# EAGLE design NIRGM V9 (EAGLE 8.5.1)

## Sheet 1 of 7: Voltage Regulator
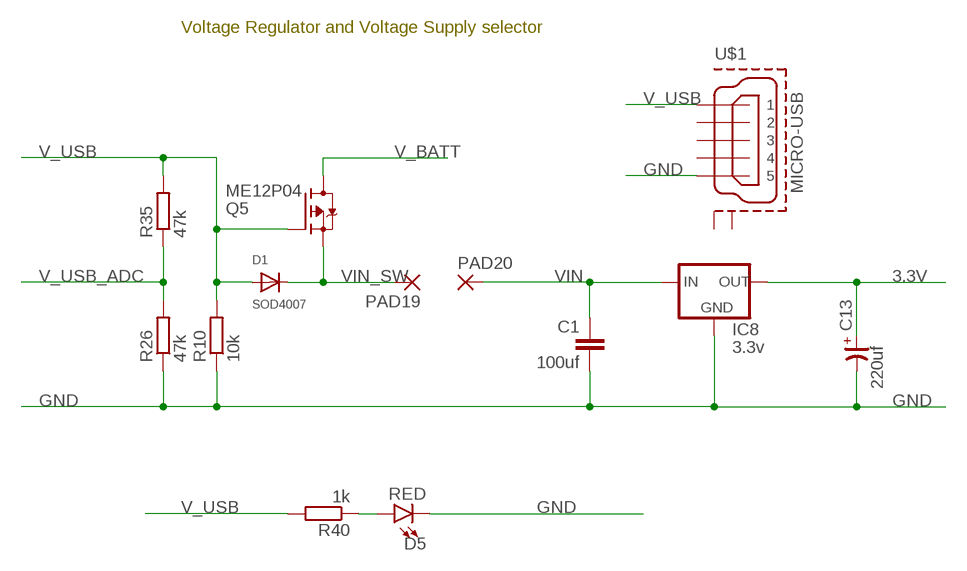
[diagram p0: schematic, sheet 1]

### Parts
C1  100uf  C-EUC1206K  [C1206K]
C13  220uf  CP-7343  [7343/T]
D1  SOD4007  DIODE_SOD-123FL  [SOD-123FL]
D5  RED  LED-GREEN1206  [LED-1206]
IC8  3.3v  LM1117TO252  [TO252]
PAD19  SMD2  [SMD1,27-2,54]
PAD20  SMD2  [SMD1,27-2,54]
Q5  ME12P04  FDD4141TO252  [TO252]
R10  10k  R-EU_R1206  [R1206]
R26  47k  R-EU_R1206  [R1206]
R35  47k  R-EU_R1206  [R1206]
R40  1k  R-EU_R1206  [R1206]
U$1  MICRO-USB  MICRO-USB-RECEPTACLE47589-0001  [47589-0001]

### Nets
3.3V: C13.+ IC8.3(OUT) ; also sheet 3,4,5,6,7
GND: C1.2 C13.- D5.C IC8.1(GND) R10.1 R26.1 U$1.5 ; also sheet 2,3,4,5,6,7
N$1: D5.A R40.1
V_BATT: Q5.3(D) ; also sheet 2,6
V_USB: D1.A Q5.1(G) R10.2 R35.2 R40.2 U$1.1 ; also sheet 2,6
V_USB_ADC: R26.2 R35.1 ; also sheet 4
VIN: C1.1 IC8.2(IN) PAD20.1(P)
VIN_SW: D1.C PAD19.1(P) Q5.2(S)
Unconnected: U$1.2 U$1.3 U$1.4 U$1.P$1(GND1) U$1.P$2(GND2)

### Notes on the sheet
- Voltage Regulator and Voltage Supply selector

## Sheet 2 of 7: Lithium-Polymer Battery Charger (1-cell)
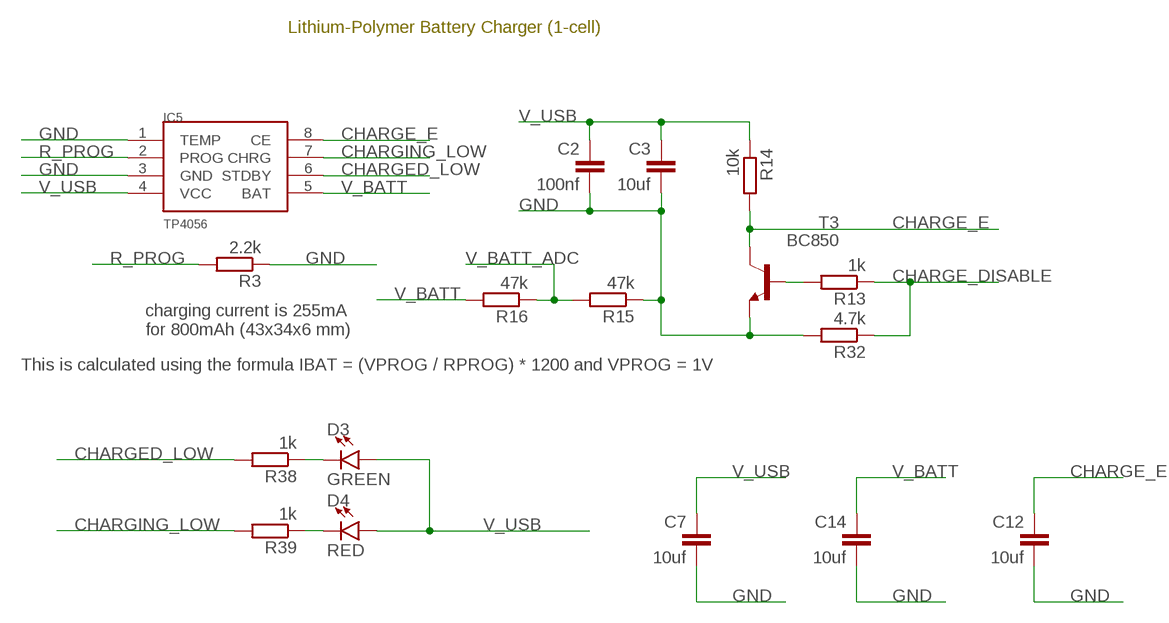
[diagram p1: schematic, sheet 2]

### Parts
C2  100nf  C-EUC1206K  [C1206K]
C3  10uf  C-EUC1206K  [C1206K]
C7  10uf  C-EUC1206K  [C1206K]
C12  10uf  C-EUC1206K  [C1206K]
C14  10uf  C-EUC1206K  [C1206K]
D3  GREEN  LED-GREEN1206  [LED-1206]
D4  RED  LED-GREEN1206  [LED-1206]
IC5  TP4056  [SOP-8]
R3  2.2k  R-EU_R1206  [R1206]
R13  1k  R-EU_R1206  [R1206]
R14  10k  R-EU_R1206  [R1206]
R15  47k  R-EU_R1206  [R1206]
R16  47k  R-EU_R1206  [R1206]
R32  4.7k  R-EU_R1206  [R1206]
R38  1k  R-EU_R1206  [R1206]
R39  1k  R-EU_R1206  [R1206]
T3  BC850  [SOT23]

### Nets
CHARGE_DISABLE: R13.1 R32.1 ; also sheet 4
CHARGE_E: C12.1 IC5.8(CE) R14.2 T3.3(C)
CHARGED_LOW: IC5.6(STDBY) R38.2 ; also sheet 4
CHARGING_LOW: IC5.7(CHRG) R39.2 ; also sheet 4
GND: C2.2 C3.2 C7.2 C12.2 C14.2 IC5.1(TEMP) IC5.3(GND) R3.1 R15.1 R32.2 T3.2(E) ; also sheet 1,3,4,5,6,7
N$2: D4.C R39.1
N$4: D3.C R38.1
N$13: R13.2 T3.1(B)
R_PROG: IC5.2(PROG) R3.2
V_BATT: C14.1 IC5.5(BAT) R16.2 ; also sheet 1,6
V_BATT_ADC: R15.2 R16.1 ; also sheet 4
V_USB: C2.1 C3.1 C7.1 D3.A D4.A IC5.4(VCC) R14.1 ; also sheet 1,6

### Notes on the sheet
- Lithium-Polymer Battery Charger (1-cell)
- charging current is 255mA
  for 800mAh (43x34x6 mm)
- This is calculated using the formula IBAT = (VPROG / RPROG) * 1200 and VPROG = 1V

## Sheet 3 of 7: LED Driver
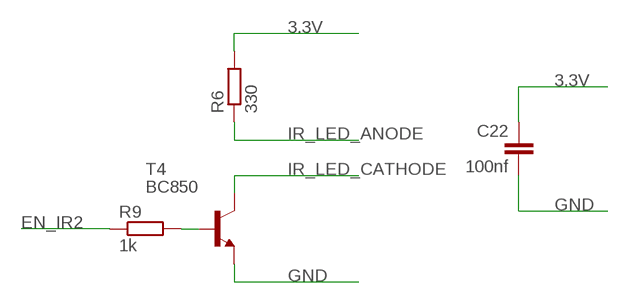
[diagram p2: schematic, sheet 3]

### Parts
C22  100nf  C-EUC1206K  [C1206K]
R6  330  R-EU_R1206  [R1206]
R9  1k  R-EU_R1206  [R1206]
T4  BC850  [SOT23]

### Nets
3.3V: C22.1 R6.2 ; also sheet 1,4,5,6,7
EN_IR2: R9.1 ; also sheet 4
GND: C22.2 T4.2(E) ; also sheet 1,2,4,5,6,7
IR_LED_ANODE: R6.1 ; also sheet 5
IR_LED_CATHODE: T4.3(C) ; also sheet 5
N$8: R9.2 T4.1(B)

## Sheet 4 of 7: ESP32
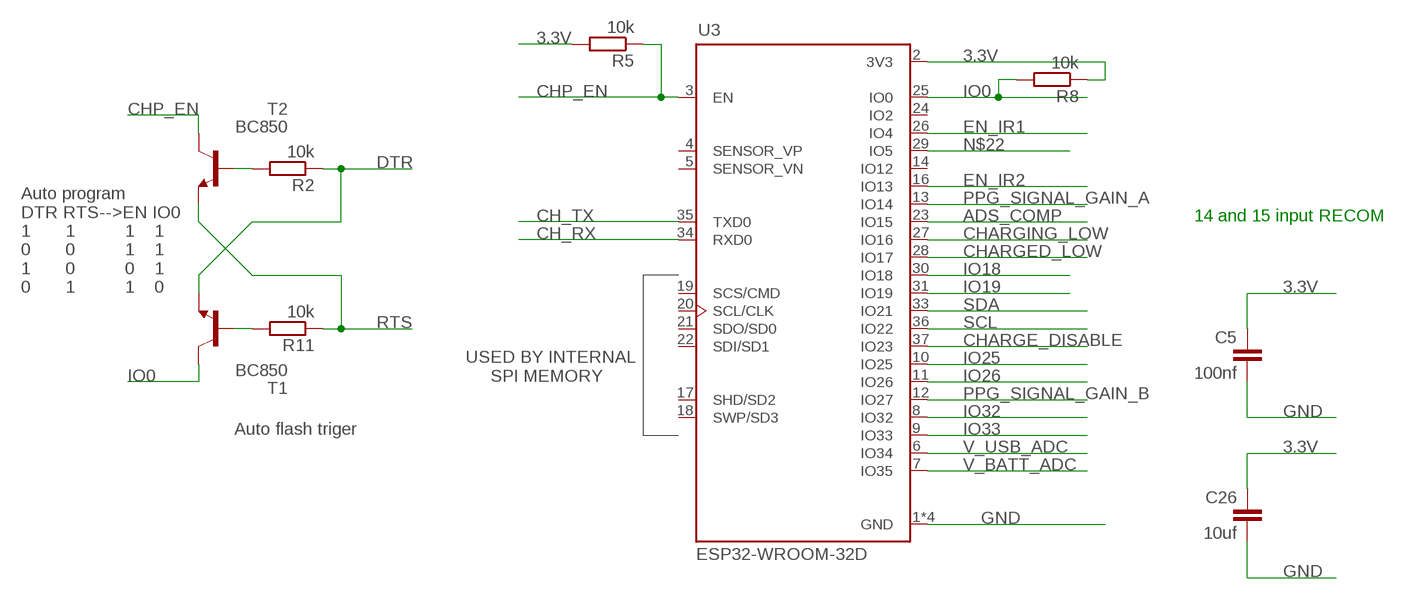
[diagram p3: schematic, sheet 4]

### Parts
C5  100nf  C-EUC1206K  [C1206K]
C26  10uf  C-EUC1206K  [C1206K]
R2  10k  R-EU_R1206  [R1206]
R5  10k  R-EU_R1206  [R1206]
R8  10k  R-EU_R1206  [R1206]
R11  10k  R-EU_R1206  [R1206]
T1  BC850  [SOT23]
T2  BC850  [SOT23]
U3  ESP32-WROOM-32D  [MODULE_ESP32-WROOM-32D]

### Nets
3.3V: C5.1 C26.1 R5.2 R8.1 U3.2(3V3) ; also sheet 1,3,5,6,7
ADS_COMP: U3.23(IO15) ; also sheet 7
CH_RX: U3.34(RXD0) ; also sheet 6
CH_TX: U3.35(TXD0) ; also sheet 6
CHARGE_DISABLE: U3.37(IO23) ; also sheet 2
CHARGED_LOW: U3.28(IO17) ; also sheet 2
CHARGING_LOW: U3.27(IO16) ; also sheet 2
CHP_EN: R5.1 T2.3(C) U3.3(EN) ; also sheet 6
DTR: R2.1 T1.2(E) ; also sheet 6
EN_IR1: U3.26(IO4)
EN_IR2: U3.16(IO13) ; also sheet 3
GND: C5.2 C26.2 U3.1(GND) U3.15(GND) U3.38(GND) U3.39(GND) ; also sheet 1,2,3,5,6,7
IO0: R8.2 T1.3(C) U3.25(IO0) ; also sheet 6
IO18: U3.30(IO18) ; also sheet 6
IO19: U3.31(IO19) ; also sheet 6
IO25: U3.10(IO25) ; also sheet 6
IO26: U3.11(IO26) ; also sheet 6
IO32: U3.8(IO32) ; also sheet 6
IO33: U3.9(IO33) ; also sheet 6
N$5: R11.2 T1.1(B)
N$18: R2.2 T2.1(B)
N$22: U3.29(IO5)
PPG_SIGNAL_GAIN_A: U3.13(IO14) ; also sheet 5
PPG_SIGNAL_GAIN_B: U3.12(IO27) ; also sheet 5
RTS: R11.1 T2.2(E) ; also sheet 6
SCL: U3.36(IO22) ; also sheet 6,7
SDA: U3.33(IO21) ; also sheet 6,7
V_BATT_ADC: U3.7(IO35) ; also sheet 2
V_USB_ADC: U3.6(IO34) ; also sheet 1
Unconnected: U3.4(SENSOR_VP) U3.5(SENSOR_VN) U3.14(IO12) U3.17(SHD/SD2) U3.18(SWP/SD3) U3.19(SCS/CMD) U3.20(SCL/CLK) U3.21(SDO/SD0) U3.22(SDI/SD1) U3.24(IO2)

### Notes on the sheet
- 14 and 15 input RECOM
- Auto program
  DTR RTS-->EN IO0 
  1       1          1    1
  0       0          1    1
  1       0          0    1
  0       1          1    0
- USED BY INTERNAL
       SPI MEMORY
- Auto flash triger

## Sheet 5 of 7: Sensor and signal processing
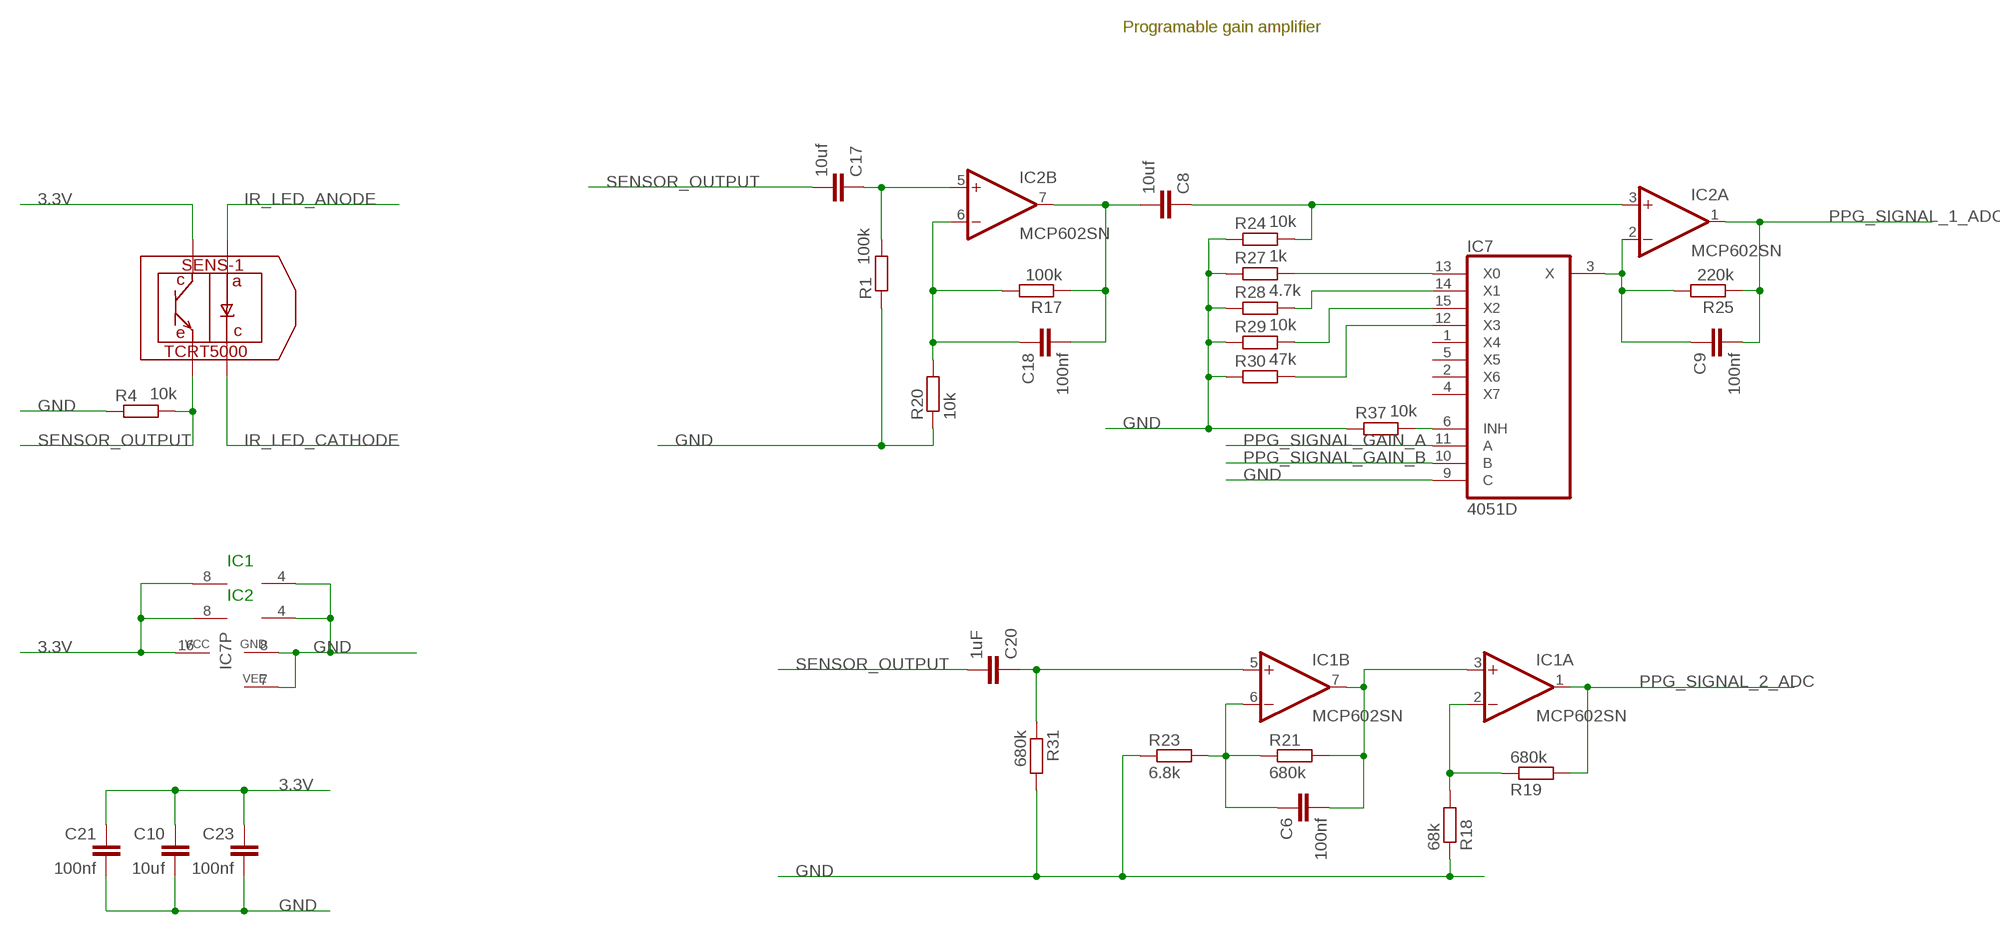
[diagram p4: schematic, sheet 5]

### Parts
C6  100nf  C-EUC1206K  [C1206K]
C8  10uf  C-EUC1206K  [C1206K]
C9  100nf  C-EUC1206K  [C1206K]
C10  10uf  C-EUC1206K  [C1206K]
C17  10uf  C-EUC1206K  [C1206K]
C18  100nf  C-EUC1206K  [C1206K]
C20  1uF  C-EUC1206K  [C1206K]
C21  100nf  C-EUC1206K  [C1206K]
C23  100nf  C-EUC1206K  [C1206K]
IC1  MCP602SN  [SO08]
IC2  MCP602SN  [SO08]
IC7  4051D  [SO16]
R1  100k  R-EU_R1206  [R1206]
R4  10k  R-EU_R1206  [R1206]
R17  100k  R-EU_R1206  [R1206]
R18  68k  R-EU_R1206  [R1206]
R19  680k  R-EU_R1206  [R1206]
R20  10k  R-EU_R1206  [R1206]
R21  680k  R-EU_R1206  [R1206]
R23  6.8k  R-EU_R1206  [R1206]
R24  10k  R-EU_R1206  [R1206]
R25  220k  R-EU_R1206  [R1206]
R27  1k  R-EU_R1206  [R1206]
R28  4.7k  R-EU_R1206  [R1206]
R29  10k  R-EU_R1206  [R1206]
R30  47k  R-EU_R1206  [R1206]
R31  680k  R-EU_R1206  [R1206]
R37  10k  R-EU_R1206  [R1206]
SENS-1  TCRT5000  [5000]

### Nets
3.3V: C10.1 C21.1 C23.1 IC1.8(P:V+) IC2.8(P:V+) IC7.16(VCC) SENS-1.P$1 ; also sheet 1,3,4,6,7
GND: C10.2 C21.2 C23.2 IC1.4(P:V-) IC2.4(P:V-) IC7.7(VEE) IC7.8(GND) IC7.9(C) R1.1 R4.1 R18.1 R20.1 R23.1 R24.1 R27.1 R28.1 R29.1 R30.1 R31.2 R37.1 ; also sheet 1,2,3,4,6,7
IR_LED_ANODE: SENS-1.P$3 ; also sheet 3
IR_LED_CATHODE: SENS-1.P$4 ; also sheet 3
N$3: IC1.2(A:-IN) R18.2 R19.1
N$6: C17.1 IC2.5(B:+IN) R1.2
N$11: IC7.6(INH) R37.2
N$12: C8.2 C18.2 IC2.7(B:OUT) R17.1
N$14: C18.1 IC2.6(B:-IN) R17.2 R20.2
N$15: C6.1 IC1.6(B:-IN) R21.1 R23.2
N$16: C20.1 IC1.5(B:+IN) R31.1
N$17: C6.2 IC1.3(A:+IN) IC1.7(B:OUT) R21.2
N$29: C8.1 IC2.3(A:+IN) R24.2
N$39: C9.1 IC2.2(A:-IN) IC7.3(X) R25.2
N$40: IC7.13(X0) R27.2
N$41: IC7.14(X1) R28.2
N$42: IC7.15(X2) R29.2
N$43: IC7.12(X3) R30.2
PPG_SIGNAL_1_ADC: C9.2 IC2.1(A:OUT) R25.1 ; also sheet 7
PPG_SIGNAL_2_ADC: IC1.1(A:OUT) R19.2 ; also sheet 7
PPG_SIGNAL_GAIN_A: IC7.11(A) ; also sheet 4
PPG_SIGNAL_GAIN_B: IC7.10(B) ; also sheet 4
SENSOR_OUTPUT: C17.2 C20.2 R4.2 SENS-1.P$2
Unconnected: IC7.1(X4) IC7.2(X6) IC7.4(X7) IC7.5(X5)

### Notes on the sheet
- Programable gain amplifier
- IC1
- IC2

## Sheet 6 of 7: OLED LCD and Connectors
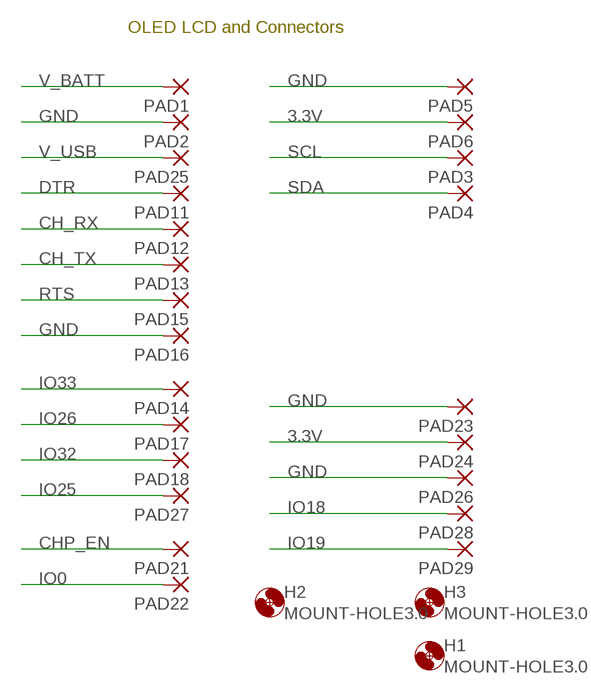
[diagram p5: schematic, sheet 6]

### Parts
H1  MOUNT-HOLE3.0  [3,0]
H2  MOUNT-HOLE3.0  [3,0]
H3  MOUNT-HOLE3.0  [3,0]
PAD1  WIREPADSMD5-2,5  [5-2,5]
PAD2  WIREPADSMD5-2,5  [5-2,5]
PAD3  SMD2  [SMD1,27-2,54]
PAD4  SMD2  [SMD1,27-2,54]
PAD5  SMD2  [SMD1,27-2,54]
PAD6  SMD2  [SMD1,27-2,54]
PAD11  SMD2  [SMD1,27-2,54]
PAD12  SMD2  [SMD1,27-2,54]
PAD13  SMD2  [SMD1,27-2,54]
PAD14  SMD2  [SMD1,27-2,54]
PAD15  SMD2  [SMD1,27-2,54]
PAD16  SMD2  [SMD1,27-2,54]
PAD17  SMD2  [SMD1,27-2,54]
PAD18  SMD2  [SMD1,27-2,54]
PAD21  SMD2  [SMD1,27-2,54]
PAD22  SMD2  [SMD1,27-2,54]
PAD23  SMD2  [SMD1,27-2,54]
PAD24  SMD2  [SMD1,27-2,54]
PAD25  SMD2  [SMD1,27-2,54]
PAD26  SMD2  [SMD1,27-2,54]
PAD27  SMD2  [SMD1,27-2,54]
PAD28  SMD2  [SMD1,27-2,54]
PAD29  SMD2  [SMD1,27-2,54]

### Nets
3.3V: PAD6.1(P) PAD24.1(P) ; also sheet 1,3,4,5,7
CH_RX: PAD12.1(P) ; also sheet 4
CH_TX: PAD13.1(P) ; also sheet 4
CHP_EN: PAD21.1(P) ; also sheet 4
DTR: PAD11.1(P) ; also sheet 4
GND: PAD2.1(P) PAD5.1(P) PAD16.1(P) PAD23.1(P) PAD26.1(P) ; also sheet 1,2,3,4,5,7
IO0: PAD22.1(P) ; also sheet 4
IO18: PAD28.1(P) ; also sheet 4
IO19: PAD29.1(P) ; also sheet 4
IO25: PAD27.1(P) ; also sheet 4
IO26: PAD17.1(P) ; also sheet 4
IO32: PAD18.1(P) ; also sheet 4
IO33: PAD14.1(P) ; also sheet 4
RTS: PAD15.1(P) ; also sheet 4
SCL: PAD3.1(P) ; also sheet 4,7
SDA: PAD4.1(P) ; also sheet 4,7
V_BATT: PAD1.1(P) ; also sheet 1,2
V_USB: PAD25.1(P) ; also sheet 1,2

### Notes on the sheet
- OLED LCD and Connectors

## Sheet 7 of 7: ADS1115
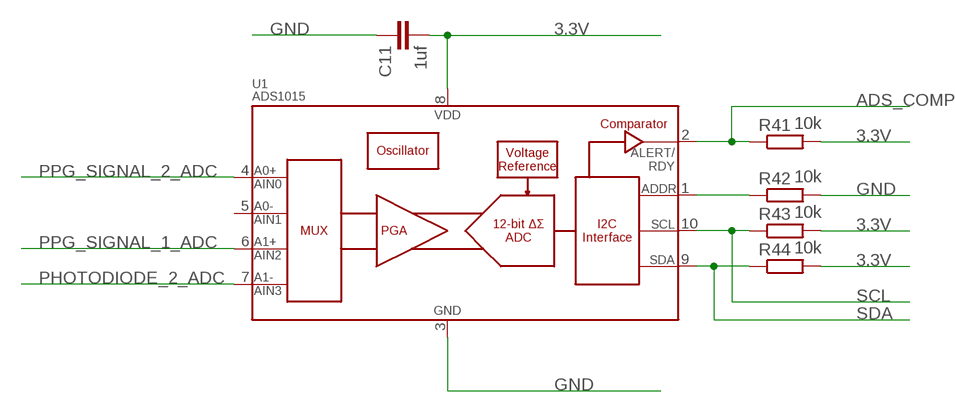
[diagram p6: schematic, sheet 7]

### Parts
C11  1uf  C-EUC1206K  [C1206K]
R41  10k  R-EU_R1206  [R1206]
R42  10k  R-EU_R1206  [R1206]
R43  10k  R-EU_R1206  [R1206]
R44  10k  R-EU_R1206  [R1206]
U1  ADS1015  [MSOP10]

### Nets
3.3V: C11.2 R41.2 R43.2 R44.2 U1.8(VDD) ; also sheet 1,3,4,5,6
ADS_COMP: R41.1 U1.2(ALERT/RDY) ; also sheet 4
GND: C11.1 R42.2 U1.3(VSS) ; also sheet 1,2,3,4,5,6
N$9: R42.1 U1.1(ADDR)
PHOTODIODE_2_ADC: U1.7(AIN3)
PPG_SIGNAL_1_ADC: U1.6(AIN2) ; also sheet 5
PPG_SIGNAL_2_ADC: U1.4(AIN0) ; also sheet 5
SCL: R43.1 U1.10(SCL) ; also sheet 4,6
SDA: R44.1 U1.9(SDA) ; also sheet 4,6
Unconnected: U1.5(AIN1)

## Library data of the parts
C1-C3 C5-C12 C14 C17 C18 C20-C23 C26 = rcl:C-EU: CAPACITOR, European symbol; SPICEPREFIX: C
C13 = cap-master:CP-: POLARIZED CAP
D1 = adafruit:DIODE: Diode SMADIODE - SMA Surface Mount Package 20V 1A Schottky Diode Digikey: 641-1014-6-ND DO-1N4148 - Through Hole Small Current Diode SOD-123 20V 1 A (.5mV Vf) Schottky Diode - Digikey: MBRX120TPMSCT-ND SOD-323 10V 570mA (.38mV Vf, 3ns) Schottky Diode - Digikey: ZLLS410CT-ND SOD-523 30V 30mA Schottky Diode (RB751S-40TE61) - Digikey: RB751S-40TE61CT-ND SOT23-R/W - SOT23 Package (R = Solder Paste/Reflow Ovens, W = Hand-Soldering) BAT54Film 40V 300mA - Digikey: 497-7162-1-ND
D3 = SparkFun-LED:LED-GREEN: Green SMD LED Used in manufacturing of various products at SparkFun Packages: 0603 - SMD 0603 package [Product Link] <http://www.futureelectronics.com/en/technologies/semiconductors/optoelectronics/leds/Pages/9894312-LTST-C190GKT.aspx?CrossPart=HSMG-C190&IM=0> LilyPad 1206 - SMD1206 LilyPad package [Product Link] <http://www.futureelectronics.com/en/Technologies/Product.aspx?ProductID=IN150NGHARVATEKCORPORATION2049943&IM=0> 1206 - SMD1206 package [Product Link] <http://www.futureelectronics.com/en/technologies/semiconductors/optoelectronics/leds/Pages/8315665-LTST-C150KGKT.aspx?IM=0> 1206 Bottom Mount -SMD 1206 Bottom Mount [Product Link] <http://www.digikey.com/product-detail/en/lite-on-inc/LTST-C230KGKT/160-1456-1-ND/386854> SparkFun Products: Pro Mini 328 -5V <https://www.sparkfun.com/products/821> RedBoard <https://www.sparkfun.com/products/12757> MP3 Trigger <https://www.sparkfun.com/products/13720> Makey Makey <https://www.sparkfun.com/products/11076>; PROD_ID: DIO-00862
D4 D5 = SparkFun-LED:LED-GREEN: Green SMD LED Used in manufacturing of various products at SparkFun Packages: 0603 - SMD 0603 package [Product Link] <http://www.futureelectronics.com/en/technologies/semiconductors/optoelectronics/leds/Pages/9894312-LTST-C190GKT.aspx?CrossPart=HSMG-C190&IM=0> LilyPad 1206 - SMD1206 LilyPad package [Product Link] <http://www.futureelectronics.com/en/Technologies/Product.aspx?ProductID=IN150NGHARVATEKCORPORATION2049943&IM=0> 1206 - SMD1206 package [Product Link] <http://www.futureelectronics.com/en/technologies/semiconductors/optoelectronics/leds/Pages/8315665-LTST-C150KGKT.aspx?IM=0> 1206 Bottom Mount -SMD 1206 Bottom Mount [Product Link] <http://www.digikey.com/product-detail/en/lite-on-inc/LTST-C230KGKT/160-1456-1-ND/386854> SparkFun Products: Pro Mini 328 -5V <https://www.sparkfun.com/products/821> RedBoard <https://www.sparkfun.com/products/12757> MP3 Trigger <https://www.sparkfun.com/products/13720> Makey Makey <https://www.sparkfun.com/products/11076>; PROD_ID: DIO-00862; VALUE: GREEN
H1-H3 = holes:MOUNT-HOLE: MOUNTING HOLE with drill center marker
IC1 IC2 = linear:MCP602: Single Op Amp 2.7V to 6.0V Single Supply CMOS Source: http://ww1.microchip.com/downloads/en/DeviceDoc/21314g.pdf
IC5 = TP4056:TP4056
IC7 = 40xx:4051: 8-channel ANALOG MULTIPLEXER
IC8 = v-reg-2:LM1117
PAD1 PAD2 = wirepad:WIREPAD: Wire PAD connect wire on PCB
PAD3-PAD6 PAD11-PAD29 = wirepad:SMD2: SMD PAD
Q5 = transistor-fet:FDD4141: P-Channel PowerTrench® MOSFET Source: FDD4141.pdf
R1-R6 R8-R11 R13-R21 R23-R32 R35 R37-R44 = rcl:R-EU_: RESISTOR, European symbol; SPICEPREFIX: R
SENS-1 = qfm-trx1-24g:TCRT5000: Reflective Optical Sensor with Transistor Output. Vishay Semiconductors
T1-T4 = transistor:BC850: NPN TRANSISTOR
U1 = SparkFun-IC-Conversion:ADS1015: ADS1015 12-BIT ADC 12-Bit Del-Sig ADC Four single-ended inputs or two differential inputs Internal PGA I2C interface 2.0-5.5V SparkFun Products SparkFun Block for Intel Edison - ADC <https://www.sparkfun.com/products/13770> (DEV-13770); PROD_ID: IC-12270
U3 = ESP32-WROOM-32DMODED:ESP32-WROOM-32D: IC: SoC; GPIO, I2C, I2S, IR, SD, SDIO, SPI, UART; 2.7÷3.6VDC; 20dBm; AVAILABILITY: Unavailable; DESCRIPTION: IC: SoC; GPIO, I2C, I2S, IR, SD, SDIO, SPI, UART; 2.7÷3.6VDC; 20dBm; MF: Espressif Systems; MP: ESP32-WROOM-32D; PACKAGE: Module Espressif Systems; PRICE: None
U$1 = con-molex-usb:MICRO-USB-RECEPTACLE: MICRO USB RECEPTACLES Micro-USB Receptacles, SMT, Lead-Free from MOLEX <http://www.molex.com/>. (C) 2014 Tomasz Boleslaw CEDRO, cederom@tlen.pl, http://www.tomek.cedro.info. Version 0.1 (2014-01-17): Initial release. Version 0.2 (2014-02-06): Updated 47589-0001 footprint pins/pads/milling. Following devices are included: 1. 47589-0001 Micro-USB AB Receptacle, Bottom Mount, SMT, Lead-Free <http://www.molex.com/molex/products/datasheet.jsp?part=active/0475890001_IO_CONNECTORS.xml> (Technical Drawing <http://www.molex.com/pdm_docs/sd/475890001_sd.pdf>).

## Board
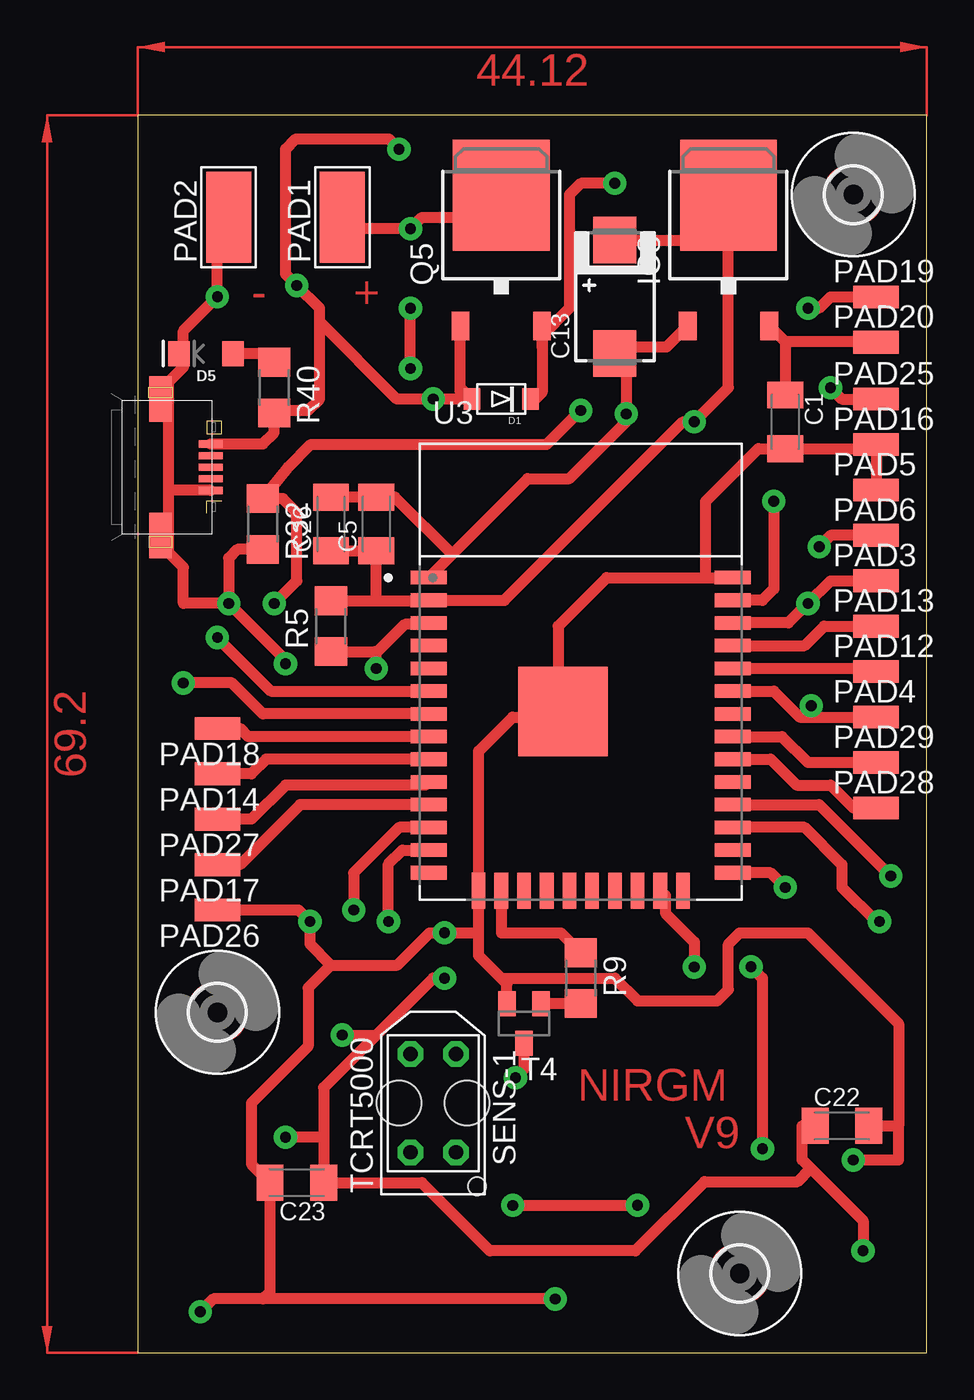
[diagram p7: board, top side]
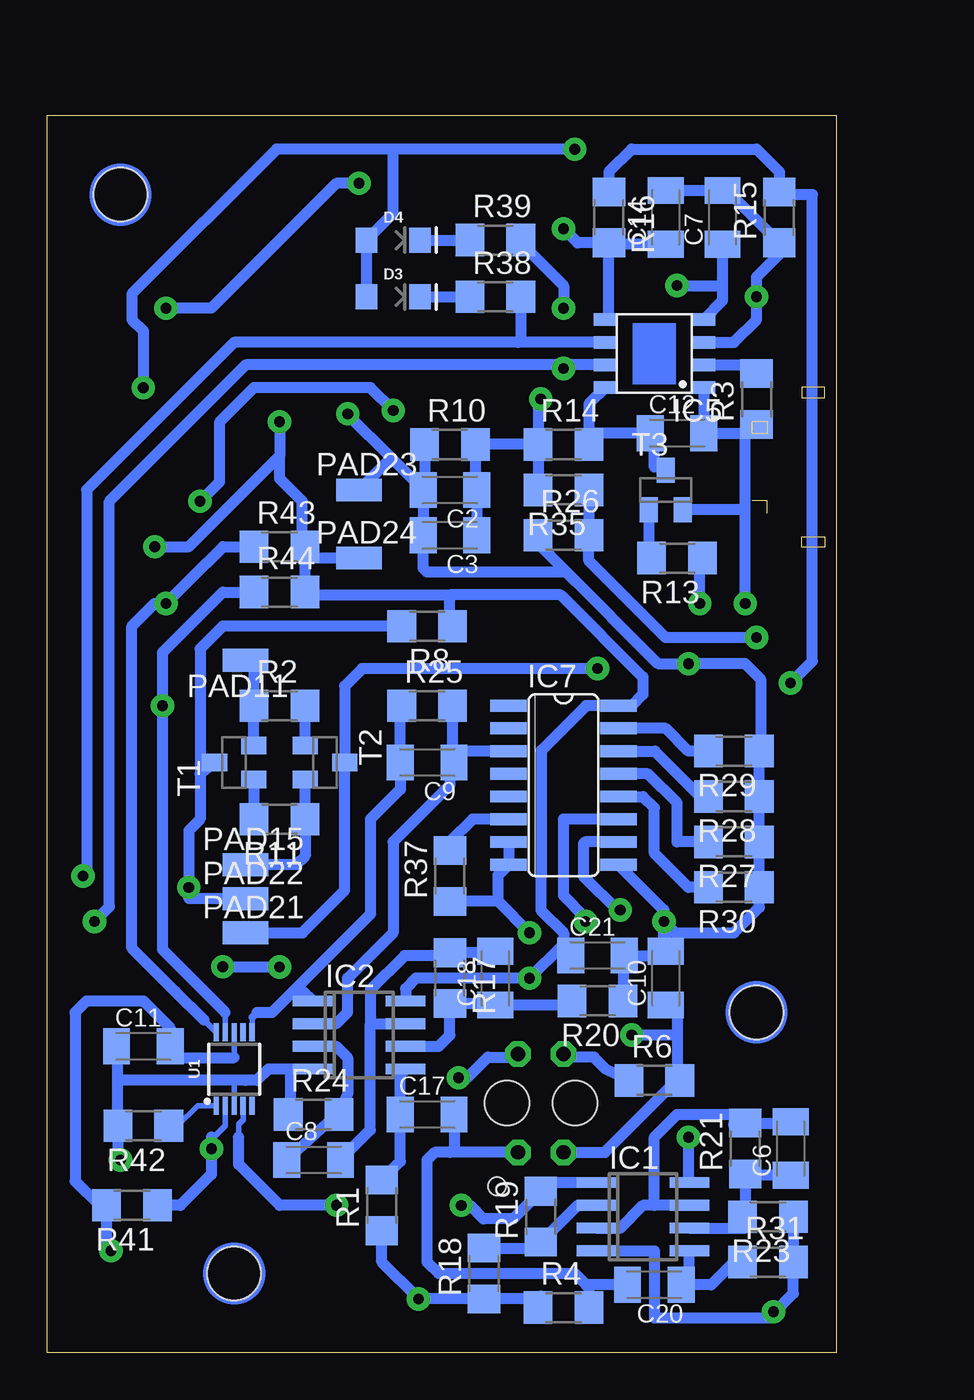
[diagram p8: board, bottom side, seen from below]

Size 44.12 x 69.2 mm. Coordinates in mm from the lower left corner, seen from the top.
Outline: 0,0 44.12,0 44.12,69.2 0,69.2 0,0
Copper layers (1*16): Top 0.035mm / dielectric 1.5mm / Bottom 0.035mm
Design rules "default *": minimum track width 6mil, minimum drill 0.35mm, track to track 12mil, track to pad 12mil, pad to pad 6mil, via to via 6mil, smd to smd 6mil, copper to edge 40mil, drill to drill 6mil, minimum pad ring 10mil, minimum via ring 8mil, stop-mask expansion 4mil, vias tented up to drill 0mil, thermal gap 10mil

### Footprints (pad centres in the part's own frame; a part is rotated, then mirrored left to right if it is on the bottom)
C1206K = smd 1.5 x 2: 1 -1.5,0; 2 1.5,0
7343/T = smd 2.6 x 2.4: + 3.175,0; - -3.175,0
SOD-123FL = smd 0.91 x 1.22: A 1.637,0; C -1.637,0
LED-1206 = smd 1.2 x 1.4: A -1.5,0; C 1.5,0
3,0 = hole 3: 0,0
SO08 = smd 0.6 x 2.2: 1 -1.905,-2.6; 2 -0.635,-2.6; 3 0.635,-2.6; 4 1.905,-2.6; 5 1.905,2.6; 6 0.635,2.6; 7 -0.635,2.6; 8 -1.905,2.6
SOP-8 = smd 1.3 x 0.7: 1 -2.75,1.905; 2 -2.75,0.635; 3 -2.75,-0.635; 4 -2.75,-1.905; 5 2.75,-1.905; 6 2.75,-0.635; 7 2.75,0.635; 8 2.75,1.905
SO16 = smd 0.66 x 2.032: 1 -4.445,-3.073; 2 -3.175,-3.073; 3 -1.905,-3.073; 4 -0.635,-3.073; 5 0.635,-3.073; 6 1.905,-3.073; 7 3.175,-3.073; 8 4.445,-3.073; 9 4.445,3.073; 10 3.175,3.073; 11 1.905,3.073; 12 0.635,3.073; 13 -0.635,3.073; 14 -1.905,3.073; 15 -3.175,3.073; 16 -4.445,3.073
TO252 = smd 1 x 1.6: 1 -2.28,-6.07; 2 2.28,-6.07 | smd 5.4 x 6.2: 3 0,1.23
5-2,5 = smd 2.54 x 5.08: 1 0,0
SMD1,27-2,54 = smd 1.27 x 2.54: 1 0,0
TO252' = smd 1 x 1.6: 1 -2.28,-4.8; 2 2.28,-4.8 | smd 5.4 x 6.2: 3 0,2.5
R1206 = smd 1.6 x 1.803: 1 -1.422,0; 2 1.422,0
5000 = drill 0.8 pad 1.422 octagon: P$1 -2.75,1.27; P$2 -2.75,-1.27; P$3 2.75,1.27; P$4 2.75,-1.27 | hole 2.5: 0,1.9; 0,-1.9 | hole 1: -4.65,-2.45
SOT23 = smd 1 x 1.4: 1 -0.95,-1.1; 2 0.95,-1.1; 3 0,1.1
MSOP10 = smd 0.3 x 1: 1 -1,-2.05; 2 -0.5,-2.05; 3 0,-2.05; 4 0.5,-2.05; 5 1,-2.05; 6 1,2.05; 7 0.5,2.05; 8 0,2.05; 9 -0.5,2.05; 10 -1,2.05
MODULE_ESP32-WROOM-32D = smd 2 x 0.762: 1 -8.5,5.26; 2 -8.5,3.99; 3 -8.5,2.72; 4 -8.5,1.45; 5 -8.5,0.18; 6 -8.5,-1.09; 7 -8.5,-2.36; 8 -8.5,-3.63; 9 -8.5,-4.9; 10 -8.5,-6.17; 11 -8.5,-7.44; 12 -8.5,-8.71; 13 -8.5,-9.98; 14 -8.5,-11.25; 25 8.5,-11.25; 26 8.5,-9.98; 27 8.5,-8.71; 28 8.5,-7.44; 29 8.5,-6.17; 30 8.5,-4.9; 31 8.5,-3.63; 32 8.5,-2.36; 33 8.5,-1.09; 34 8.5,0.18; 35 8.5,1.45; 36 8.5,2.72; 37 8.5,3.99; 38 8.5,5.26 | smd 0.762 x 2: 15 -5.715,-12.25; 16 -4.445,-12.25; 17 -3.175,-12.25; 18 -1.905,-12.25; 19 -0.635,-12.25; 20 0.635,-12.25; 21 1.905,-12.25; 22 3.175,-12.25; 23 4.445,-12.25; 24 5.715,-12.25 | smd 5 x 5: 39 -1,-2.24
47589-0001 = smd 1.35 x 0.4: 1 2.8,1.3; 2 2.8,0.65; 3 2.8,0; 4 2.8,-0.65; 5 2.8,-1.3 | smd 1.27 x 2.54: P$1 0,3.81; P$2 0,-3.81

### Placement (x,y rotation side)
C1  36.2,52.07 270 top
C2  21.59,48.26 180 bottom
C3  21.59,45.72 180 bottom
C5  13.34,46.35 90 top
C6  2.54,11.43 90 bottom
C7  6.35,63.5 90 bottom
C8  29.21,10.79 0 bottom
C9  22.86,33.02 180 bottom
C10  9.53,20.95 90 bottom
C11  38.73,17.14 0 bottom
C12  8.89,51.44 0 bottom
C13  26.67,59.05 90 top
C14  9.53,63.5 90 bottom
C17  22.86,13.34 0 bottom
C18  19.05,20.95 90 bottom
C20  10.16,3.81 180 bottom
C21  13.34,22.23 0 bottom
C22  39.37,12.7 0 top
C23  8.89,9.53 180 top
C26  10.79,46.35 90 top
D1  20.32,53.34 180 top
D3  24.77,59.05 0 bottom
D4  24.77,62.23 0 bottom
D5  3.81,55.88 180 top
H1  40.01,64.77 0 top
H2  4.45,19.05 0 top
H3  33.66,4.45 0 top
IC1  10.79,7.62 270 bottom
IC2  26.67,17.78 270 bottom
IC5  10.16,55.88 180 bottom
IC7  15.24,31.75 270 bottom
IC8  33.02,63.5 0 top
PAD1  11.43,63.5 0 top
PAD2  5.08,63.5 0 top
PAD3  41.27,43.18 270 top
PAD4  41.27,35.56 270 top
PAD5  41.27,48.26 270 top
PAD6  41.27,45.72 270 top
PAD11  33.02,38.73 90 bottom
PAD12  41.27,38.1 270 top
PAD13  41.27,40.64 270 top
PAD14  4.45,32.38 90 top
PAD15  33.02,27.3 270 bottom
PAD16  41.27,50.8 270 top
PAD17  4.45,27.3 90 top
PAD18  4.45,34.92 90 top
PAD19  41.27,59.05 270 top
PAD20  41.27,56.52 270 top
PAD21  33.02,23.5 270 bottom
PAD22  33.02,25.4 270 bottom
PAD23  26.67,48.26 270 bottom
PAD24  26.67,44.45 270 bottom
PAD25  41.27,53.34 270 top
PAD26  4.45,24.77 90 top
PAD27  4.45,29.84 90 top
PAD28  41.27,30.48 270 top
PAD29  41.27,33.02 270 top
Q5  ME12P04  [TO252']  20.32,62.23 0 top
R1  25.4,8.26 90 bottom
R2  31.11,36.2 0 bottom
R3  4.45,53.34 90 bottom
R4  15.24,2.54 0 bottom
R5  10.79,40.64 90 top
R6  10.16,15.24 0 bottom
R8  22.86,40.64 180 bottom
R9  24.77,20.95 270 top
R10  21.59,50.8 0 bottom
R11  31.11,29.84 180 bottom
R13  8.89,44.45 180 bottom
R14  15.24,50.8 0 bottom
R15  3.17,63.5 90 bottom
R16  12.7,63.5 270 bottom
R17  21.59,20.95 270 bottom
R18  19.68,4.45 90 bottom
R19  16.51,7.62 90 bottom
R20  13.34,19.68 180 bottom
R21  5.08,11.43 90 bottom
R23  3.81,7.62 180 bottom
R24  29.21,13.34 0 bottom
R25  22.86,36.2 0 bottom
R26  15.24,45.72 0 bottom
R27  5.71,28.57 180 bottom
R28  5.71,31.11 180 bottom
R29  5.71,33.66 180 bottom
R30  5.71,26.04 180 bottom
R31  3.81,5.08 0 bottom
R32  6.99,46.35 270 top
R35  15.24,48.26 180 bottom
R37  21.59,26.67 90 bottom
R38  19.05,59.05 0 bottom
R39  19.05,62.23 0 bottom
R40  7.62,53.98 270 top
R41  39.37,8.26 180 bottom
R42  38.73,12.7 180 bottom
R43  31.11,45.09 0 bottom
R44  31.11,42.55 0 bottom
SENS-1  16.51,13.97 90 top
T1  33.66,33.02 90 bottom
T2  28.57,33.02 270 bottom
T3  9.53,48.26 0 bottom
T4  21.59,18.41 180 top
U1  33.66,15.88 0 bottom
U3  24.77,38.1 0 top
U$1  1.27,49.53 0 top

### Tracks (layer width: path | path; a pad name or v marks a point on that pad's centre or on a via)
3.3V  (via drill 0.6 pad 1.3)
  Top 0.61: IC8.3 33.02,53.98 v31.11,52.07 30.48,52.07 20.5,42.09 U3.2 16.24,42.06 13.34,42.06 | IC8.3 32.12,64.36 | R5.2 13.34,42.06 | 13.34,42.06 C5.1 C26.1 | C13.+ 31.75,62.23 32.98,63.46 IC8.3 | v17.14,20.95 16.51,20.95 13.34,17.78 | 37.62,10.32 37.15,10.79 37.15,12.7 C22.1 | 37.62,10.32 40.55,7.39 v40.55,5.71 | 13.34,17.78 10.39,14.84 10.39,12.06 | PAD6.1 38.73,45.72 v38.1,45.09 | 10.39,12.06 C23.1 15.88,9.53 19.68,5.71 27.82,5.71 31.69,9.59 36.89,9.59 37.62,10.32 | 10.39,12.06 v8.26,12.06 | v11.43,17.78 13.34,17.78
  Bottom 0.305: 33.66,16.51 U1.8
  Bottom 0.61: v31.11,52.07 31.11,50.16 | v38.1,45.09 36.2,45.09 31.11,50.16 | 29.69,44.45 R44.2 29.54,42.39 21.59,42.39 | 29.69,44.45 R43.2 29.84,45.24 29.84,47.62 31.11,48.9 31.11,50.16 | 33.66,16.51 36.6,16.51 C11.2 37.23,18.18 38.73,19.68 41.91,19.68 42.55,19.05 42.55,9.62 41.18,8.26 R41.2 | 21.59,42.39 15.39,42.39 10.79,37.79 10.79,36.83 11.43,36.2 IC7.16 13.97,36.2 16.48,33.68 16.48,26.64 16.51,26.61 16.51,24.77 15.24,23.5 15.24,22.86 | R8.1 21.59,40.79 21.59,42.39 | PAD24.1 29.69,44.45 | IC2.8 24.07,20.38 23.5,20.95 v17.14,20.95 15.24,22.86 | R41.2 40.64,8.1 | C21.1 14.84,22.45 15.24,22.86 | C10.1 8.89,18.82 8.89,17.78 | 8.89,17.78 8.89,16.03 R6.2 8.91,15.24 12.93,11.22 SENS-1.P$1 | v8.26,12.06 8.26,9.59 IC1.8 | 8.89,17.78 v11.43,17.78 | v40.55,5.71 40.79,5.96 R41.2
ADS_COMP  (via drill 0.6 pad 1.3)
  Top 0.61: U3.23 29.49,25.57 29.49,24.6 31.11,22.97 v31.11,21.58 | v34.29,21.59 34.92,20.95 v34.92,11.42
  Bottom 0.305: U1.2 34.16,12.7 34.79,12.06 34.92,12.06
  Bottom 0.61: 34.92,12.06 v34.92,11.42 34.92,9.99 36.66,8.26 R41.1 | v31.11,21.58 v34.28,21.58 v34.29,21.59
CH_RX
  Top 0.61: PAD12.1 41.09,38.28 U3.34
CH_TX
  Top 0.61: U3.35 37.28,39.55 38.38,40.64 PAD13.1
CHARGE_DISABLE  (via drill 0.6 pad 1.3)
  Top 0.61: v24.77,52.7 22.86,50.8 9.68,50.8 8.41,49.53 R32.1 8.1,47.78 8.89,46.99 8.89,43.18 v7.62,41.91 | U3.37 34.92,42.09 35.56,42.73 v35.56,47.62
  Bottom 0.61: v7.62,41.91 7.62,44.45 R13.1 | v35.56,47.62 34.48,48.7 34.48,52.04 32.55,53.98 26.04,53.98 v24.77,52.7
CHARGE_E
  Bottom 0.61: IC5.8 13.82,53.07 13.82,51.44 | 13.82,51.44 R14.2 | 13.82,51.44 C12.1 10.16,51.2 10.16,49.53 9.7,49.53 T3.3
CHARGED_LOW  (via drill 0.6 pad 1.3)
  Top 0.61: U3.28 38.1,30.66 v42.09,26.67 v42.1,26.67
  Bottom 0.61: IC5.6 17.78,56.52 | 17.78,56.52 33.66,56.52 41.91,48.26 41.91,26.86 v42.1,26.67 | R38.2 17.63,56.67 17.78,56.52
CHARGING_LOW  (via drill 0.6 pad 1.3)
  Top 0.61: v15.24,55.05 v15.24,58.42 | U3.27 37.28,29.39 39.37,27.3 39.37,26.04 41.27,24.13 v41.47,24.13
  Bottom 0.61: IC5.7 15.24,55.24 | 15.24,55.24 v15.24,55.05 | v15.24,58.42 15.24,59.69 17.63,62.08 R39.2 | 15.24,55.24 33.02,55.24 40.64,47.62 40.64,24.96 v41.47,24.13
CHP_EN  (via drill 0.6 pad 1.3)
  Top 0.61: U3.3 16.19,40.74 14.93,40.74 13.34,39.15 | v13.34,38.27 13.34,39.15 | R5.1 13.27,39.22 13.34,39.15
  Bottom 0.61: v13.34,38.27 26.5,38.27 27.48,37.3 T2.3 27.48,25.86 29.84,23.5 PAD21.1
DTR
  Bottom 0.61: T1.2 32.55,36.18 R2.1 32.54,38.58 PAD11.1
EN_IR2
  Top 0.61: R9.1 23.65,23.5 20.32,23.5 U3.16
GND  (via drill 0.6 pad 1.3)
  Top 0.61: PAD2.1 5.08,62.23 4.45,61.59 v4.45,59.05 2.54,57.15 2.54,55.88 | U3.39 24.77,36.86 | 1.73,48.26 1.73,44.75 2.54,43.94 2.54,41.91 v5.08,41.91 | 1.73,48.26 1.73,54.31 2.54,55.12 2.54,55.88 | U3.39 23.5,36.13 23.5,40.64 26.21,43.36 31.75,43.36 | 31.75,43.36 U3.38 | U3.39 23.77,35.83 23.5,35.56 20.95,35.56 19.05,33.66 U3.15 19.05,23.5 | 31.75,43.36 31.75,47.62 34.7,50.57 C1.2 40.51,50.57 40.65,50.72 PAD16.1 PAD5.1 | 19.05,23.5 v17.14,23.5 16.31,23.5 14.5,21.69 10.79,21.69 | U3.1 17.57,44.66 | 17.57,44.66 21.8,48.9 24.13,48.9 27.3,52.07 v27.3,52.51 27.3,55.24 C13.- 26.95,56.16 27.18,56.24 29.55,56.24 IC8.1 | v5.08,41.91 8.26,38.73 v8.26,38.54 | 42.55,12.7 42.55,10.79 v40.01,10.79 | C22.2 42.55,12.7 | U$1.5 1.76,48.23 1.73,48.26 | v5.08,41.91 5.08,44.45 5.56,44.93 R32.2 | D5.C 2.54,55.88 | 17.57,44.66 14.38,47.85 C5.2 C26.2 | 9.63,23.39 v9.63,24.13 | v9.63,24.13 9.63,22.86 10.79,21.69 | T4.2 20.64,20.64 20.32,20.95 | 20.32,20.95 19.05,22.23 19.05,23.5 | 20.32,20.95 26.67,20.95 27.94,19.68 32.38,19.68 33.02,20.32 33.02,22.86 33.66,23.5 37.47,23.5 42.55,18.41 42.55,12.7 | v23.34,3.02 6.99,3.02 | 6.99,3.02 4.21,3.02 v3.49,2.3 | 6.99,3.02 7.39,3.43 C23.2 6.35,10.56 6.35,13.97 9.53,17.14 9.53,20.42 10.79,21.69 | v9.63,24.13 8.99,24.77 PAD26.1
  Bottom 0.305: U1.3 33.66,15.24 | 33.66,15.24 33.02,15.24 | 33.66,15.24 40.01,15.24 40.16,15.24
  Bottom 0.61: R10.1 23.01,48.34 C2.2 | C2.2 C3.2 23.09,43.89 22.86,43.66 15.09,43.66 14.61,43.18 | IC5.3 5.71,56.52 4.45,57.78 v4.45,59.05 4.45,60.17 3.17,61.44 R15.1 6.1,65 C7.2 C14.2 | v5.08,41.91 5.08,46.99 | T3.2 5.25,47.16 5.08,46.99 | 15.24,43.81 16.66,45.24 R26.1 16.83,45.55 | IC7.7 IC7.8 | 4.29,32.87 4.45,33.02 | IC7.8 19.05,27.3 | 14.61,43.18 | 14.61,43.18 15.24,43.81 | 15.24,43.81 | C2.2 24.88,50.05 | 24.88,50.05 27.3,52.48 v27.3,52.51 | IC7.9 9.63,24.77 v9.63,24.13 | C11.1 40.16,17.7 40.16,15.24 R42.2 40.16,10.95 v40.01,10.79 | v9.63,24.13 9.63,22.23 C21.2 11.91,22.15 R20.1 | 40.01,15.24 33.02,15.24 32.38,15.24 31.75,15.88 30.48,15.88 | 4.29,32.87 R29.1 4.21,33.73 4.21,37.68 5.08,38.54 v8.26,38.54 9.97,38.54 15.24,43.81 | 4.29,32.87 R28.1 R27.1 R30.1 4.29,24.92 5.71,23.5 8.99,23.5 v9.63,24.13 | IC2.4 30.48,15.88 | 5.08,51.44 C12.2 7.41,51.45 IC5.1 | 5.08,51.44 4.45,51.44 R3.1 | 5.08,46.99 5.08,51.44 | PAD23.1 24.88,50.05 | 20.8,25.25 R37.1 18.9,25.25 | v17.14,23.5 18.9,25.25 | 18.9,25.25 18.9,26.72 IC7.8 | R24.1 30.48,14.12 30.48,15.88 | C10.2 9.53,24.03 v9.63,24.13 | R23.1 R31.2 2.39,3.33 3.49,2.22 | 13.97,5.71 IC1.4 10.16,5.71 10.16,1.96 3.76,1.96 3.49,2.22 | 16.51,3.17 R4.1 16.81,3.02 R18.1 v23.34,3.02 25.4,5.08 R1.1 | v3.49,2.3 3.49,2.22
IO0  (via drill 0.6 pad 1.3)
  Top 0.61: v36.2,26.04 35.38,26.85 U3.25
  Bottom 0.61: R8.2 34.29,40.64 35.56,39.37 35.56,32.38 | 35.56,32.38 35.56,29.84 36.2,29.21 v36.2,26.04 36.2,25.4 PAD22.1 | T1.3 35.56,32.38
IO18
  Top 0.61: U3.30 35.38,33.2 36.83,31.75 38.73,31.75 40.01,30.48 PAD28.1
IO19
  Top 0.61: U3.31 36.02,34.47 37.47,33.02 PAD29.1
IO25
  Top 0.61: U3.10 16.09,31.75 8.26,31.75 6.35,29.84 PAD27.1
IO26
  Top 0.61: U3.11 9.07,30.66 5.71,27.3 PAD17.1
IO32
  Top 0.61: U3.8 6.17,34.47 5.71,34.92 PAD18.1
IO33
  Top 0.61: U3.9 7.17,33.2 6.35,32.38 PAD14.1
IR_LED_ANODE
  Bottom 0.61: R6.1 12.88,15.88 13.54,16.54 15.06,16.54 SENS-1.P$3
IR_LED_CATHODE  (via drill 0.6 pad 1.3)
  Top 0.61: T4.3 21.59,15.88 v21.11,15.39
  Bottom 0.61: v21.11,15.39 20.62,15.39 19.48,16.54 17.96,16.54 SENS-1.P$4
N$1
  Top 0.61: R40.1 7.47,55.4 6.99,55.88 D5.A
N$2
  Bottom 0.61: D4.C R39.1
N$3
  Bottom 0.61: IC1.2 14.45,8.26 R19.1 16.84,5.87 R18.2
N$4
  Bottom 0.61: D3.C R38.1
N$5
  Bottom 0.61: R11.2 32.54,32.05 T1.1
N$6
  Bottom 0.61: R1.2 24.36,10.72 C17.1 24.36,15.59 IC2.5
N$8
  Top 0.61: R9.2 24.15,19.52 T4.1
N$9
  Bottom 0.305: U1.1 35.7,13.82 36.83,12.7 R42.1
N$11
  Bottom 0.61: IC7.6 20.32,29.84 21.59,28.57 R37.2
N$12
  Bottom 0.61: C18.2 19.13,22.38 R17.1 21.74,22.23 24.13,22.23 26.04,20.32 26.04,18.41 | 26.04,18.41 IC2.7 | C8.2 26.04,12.47 26.04,18.41
N$13
  Bottom 0.61: T3.1 10.47,44.61 R13.2
N$14
  Bottom 0.61: R20.2 14.99,19.45 C18.1 19.13,19.53 R17.2 21.59,17.78 22.23,17.14 IC2.6
N$15
  Bottom 0.61: C6.1 5,9.93 R21.1 5.08,7.77 R23.2 5.08,7.47 5.08,6.99 IC1.6
N$16
  Bottom 0.61: R31.1 5.71,5.08 6.99,3.81 C20.1 8.2,4.28 IC1.5
N$17
  Bottom 0.61: R21.2 5.71,12.85 5.71,12.7 | R21.2 2.62,12.85 C6.2 | IC1.7 10.16,8.26 | 10.16,8.26 10.79,8.26 12.06,6.99 IC1.3 | R21.2 5.56,13.34 8.89,13.34 10.16,12.06 10.16,8.26
N$18
  Bottom 0.61: T2.1 29.68,36.18 R2.2
N$29
  Bottom 0.61: C8.1 27.54,13.72 R24.2 27.3,14.45 27.3,16.51 27.94,17.14 IC2.3
N$39
  Bottom 0.61: 21.44,33.66 21.44,33.1 C9.1 21.59,32.79 21.59,31.75 24.77,28.57 24.77,23.5 27.3,20.95 27.3,19.05 27.94,18.41 IC2.2 | 21.44,33.66 R25.2 | IC7.3 21.44,33.66
N$40
  Bottom 0.61: IC7.13 10.52,32.38 8.89,30.76 8.89,28.57 R27.2
N$41
  Bottom 0.61: IC7.14 10.14,33.66 7.6,31.11 R28.2
N$42
  Bottom 0.61: IC7.15 9.53,34.92 8.26,33.66 R29.2
N$43
  Bottom 0.61: IC7.12 10.79,31.11 10.16,30.48 10.16,27.94 8.26,26.04 R30.2
PPG_SIGNAL_1_ADC
  Bottom 0.305: U1.6 32.66,18.78
  Bottom 0.406: 32.66,18.78 32.38,19.05
  Bottom 0.61: R25.1 24.36,36.12 C9.2 24.36,31.52 26.04,29.84 26.04,24.55 30.37,20.21 | IC2.1 29.8,20.21 30.37,20.21 | 32.38,19.05 31.53,19.05 30.37,20.21
PPG_SIGNAL_2_ADC  (via drill 0.6 pad 1.3)
  Top 0.61: v20.96,8.25 v27.94,8.25 v27.94,8.26
  Bottom 0.305: U1.4 33.16,13.03 33.41,12.78 33.41,12.06
  Bottom 0.61: 33.41,12.06 33.41,10.54 31.11,8.26 v27.94,8.26 | IC1.1 16.03,9.53 R19.2 18.05,7.5 19.71,7.5 20.47,8.25 v20.96,8.25
PPG_SIGNAL_GAIN_A  (via drill 0.6 pad 1.3)
  Top 0.61: v14.01,24.13 14.01,27.34 14.79,28.12 U3.13
  Bottom 0.61: IC7.11 15.24,29.84 15.24,25.57 14.01,24.34 v14.01,24.13
PPG_SIGNAL_GAIN_B  (via drill 0.6 pad 1.3)
  Top 0.61: U3.12 14.61,29.39 12.06,26.85 v12.06,24.77
  Bottom 0.61: v12.06,24.77 12.22,24.77 14.12,26.67 14.12,28.48 14.03,28.57 IC7.10
R_PROG
  Bottom 0.61: IC5.2 4.93,55.24 R3.2
RTS
  Bottom 0.61: T2.2 29.69,32.05 R11.1 29.69,27.79 30.18,27.3 PAD15.1
SCL  (via drill 0.6 pad 1.3)
  Top 0.61: PAD3.1 40.87,42.88 40.56,43.18 38.73,43.18 v37.47,41.91 36.38,40.82 U3.36
  Bottom 0.305: U1.10 35.35,18.62 | 36.94,20.21 38.77,22.05
  Bottom 0.61: R43.1 34.27,45.09 35.18,44.17 35.2,44.17 v37.47,41.91 38.1,41.91 39.37,40.64 39.37,22.64 36.94,20.21 35.35,18.62
SDA  (via drill 0.6 pad 1.3)
  Top 0.61: U3.33 35.56,37.01 37.01,35.56 37.47,35.56 | 37.47,35.56 PAD4.1 | v37.66,36.2 37.47,36 37.47,35.56
  Bottom 0.305: U1.9 34.16,19.05
  Bottom 0.61: v37.66,36.2 37.47,36.2 | v37.66,36.2 37.66,39.18 34.29,42.55 R44.1 | 34.16,19.05 37.66,22.55 v37.66,36.2
SENSOR_OUTPUT
  Bottom 0.61: 20.98,12.9 20.98,12.96 C17.2 21.36,11.45 21.59,11.22 | 17.86,11.14 SENS-1.P$2 21.59,11.22 | 21.59,11.22 22.43,11.22 22.86,10.79 22.86,5.08 22.23,4.45 14.61,4.45 13.97,3.81 | R4.2 13.82,3.66 13.97,3.81 | C20.2 13.97,3.81
V_BATT  (via drill 0.6 pad 1.3)
  Top 0.61: PAD1.1 11.43,62.87 v15.24,62.87 15.88,63.5 20.28,63.5 Q5.3
  Bottom 0.61: R16.2 14.45,62.08 v15.24,62.87 | IC5.5 12.7,57.99 R16.2 | C14.1 12.62,62 R16.2
V_BATT_ADC  (via drill 0.6 pad 1.3)
  Top 0.61: U3.7 6.99,35.74 5.26,37.47 v2.54,37.47
  Bottom 0.61: R16.1 12.7,66.04 11.43,67.31 4.45,67.31 3.17,66.04 R15.2 3.02,64.77 1.32,64.77 1.32,38.68 v2.54,37.47
V_USB  (via drill 0.6 pad 1.3)
  Top 0.61: 18.04,53.98 D1.A 18.41,53.34 | 18.04,53.98 Q5.1 | 18.41,53.34 v16.51,53.34 14.49,53.34 10.16,57.67 | 18.04,53.98 18.04,53.72 18.41,53.34 | v14.61,67.31 14.03,67.88 8.83,67.88 8.26,67.31 8.26,60.33 v8.89,59.69 10.16,58.42 10.16,57.67 | U$1.1 6.99,50.83 7.62,51.47 R40.2 7.77,52.7 9.53,52.7 10.16,53.34 10.16,57.67 | v38.73,53.98 39.37,53.34 PAD25.1
  Bottom 0.61: R14.1 R35.2 | R14.1 R10.2 20.17,48.34 C2.1 C3.1 | v16.51,53.34 16.66,53.19 R14.1 | v14.61,67.31 24.77,67.31 | C7.1 6.35,59.69 | 6.35,59.69 6.35,58.84 IC5.4 | v8.89,59.69 6.35,59.69 | 24.77,67.31 24.77,63.73 D4.A D3.A | 24.77,67.31 31.29,67.31 39.37,59.23 39.37,57.78 38.73,57.15 v38.73,53.98
V_USB_ADC  (via drill 0.6 pad 1.3)
  Top 0.61: v4.45,40.01 7.44,37.01 U3.6
  Bottom 0.61: R35.1 R26.2 13.82,44.3 9.53,40.01 v4.45,40.01
VIN
  Top 0.61: IC8.2 36.2,56.53 | 36.2,56.53 C1.1 36.41,53.79 | PAD20.1 41.26,56.53 36.2,56.53
VIN_SW  (via drill 0.6 pad 1.3)
  Top 0.61: 22.6,56.26 Q5.2 | Q5.2 22.6,56.89 24.13,58.42 24.13,64.77 24.77,65.41 v26.67,65.41 | PAD19.1 40.66,58.95 40.55,59.05 38.73,59.05 38.1,58.42 v37.47,58.42 | D1.C 22.23,53.34 22.6,53.72 Q5.2
  Bottom 0.61: v26.67,65.41 27.94,65.41 34.92,58.42 v37.47,58.42
(copper drawn outside any net)
  shapes: Bottom circle x6, Top area x2, Top circle x6

### Text on the board
Top: - | + | NIRGM / V9